# EAGLE design Circuito_Fonte (EAGLE 9.6.2)

## Sheet 1 of 2

## Sheet 2 of 2
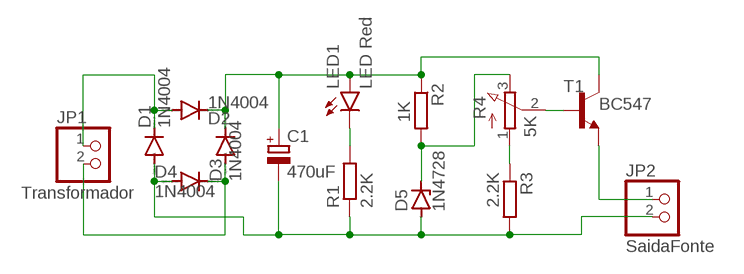
[diagram p0: schematic, sheet 2]

### Parts
C1  470uF  CPOL-EUE5-10.5  [E5-10,5]
D1  1N4004  [DO41-10]
D2  1N4004  [DO41-10]
D3  1N4004  [DO41-10]
D4  1N4004  [DO41-10]
D5  1N4728  [DO41Z10]
JP1  Transformador  PINHD-1X2  [1X02]
JP2  SaidaFonte  PINHD-1X2  [1X02]
LED1  LED Red  LED5MM  [LED5MM]
R1  2.2K  R-EU_0204/7  [0204/7]
R2  1K  R-EU_0204/7  [0204/7]
R3  2.2K  R-EU_0204/7  [0204/7]
R4  5K  3RP/1610N  [3RP/1610N]
T1  BC547  [TO92]

### Nets
N$1: D1.C D2.A JP1.1
N$2: D3.A D4.C JP1.2
N$3: C1.+ D2.C D3.C LED1.A R2.1 T1.3(C)
N$4: LED1.K(C) R1.2
N$5: D5.C R2.2 R4.3(E)
N$7: R3.1 R4.1(A)
N$8: R4.2(S) T1.2(B)
N$9: JP2.1 T1.1(E)
N$10: C1.- D1.A D4.A D5.A JP2.2 R1.1 R3.2

## Library data of the parts
C1 = rcl:CPOL-EU: POLARIZED CAPACITOR, European symbol; SPICEPREFIX: C
D1-D4 = diode:1N4004: DIODE general purpose rectifier, 1 A
D5 = diode:1N4728: Z DIODE 3.3 V, 1W, 5 percent
JP1 JP2 = pinhead:PINHD-1X2: PIN HEADER
LED1 = led:LED: LED OSRAM: - CHIPLED LG R971, LG N971, LY N971, LG Q971, LY Q971, LO R971, LY R971 LH N974, LH R974 LS Q976, LO Q976, LY Q976 LO Q996 - Hyper CHIPLED LW Q18S LB Q993, LB Q99A, LB R99A - SideLED LS A670, LO A670, LY A670, LG A670, LP A670 LB A673, LV A673, LT A673, LW A673 LH A674 LY A675 LS A676, LA A676, LO A676, LY A676, LW A676 LS A679, LY A679, LG A679 - Hyper Micro SIDELED® LS Y876, LA Y876, LO Y876, LY Y876 LT Y87S - SmartLED LW L88C, LW L88S LB L89C, LB L89S, LG L890 LS L89K, LO L89K, LY L89K LS L896, LA L896, LO L896, LY L896 - TOPLED LS T670, LO T670, LY T670, LG T670, LP T670 LSG T670, LSP T670, LSY T670, LOP T670, LYG T670 LG T671, LOG T671, LSG T671 LB T673, LV T673, LT T673, LW T673 LH T674 LS T676, LA T676, LO T676, LY T676, LB T676, LH T676, LSB T676, LW T676 LB T67C, LV T67C, LT T67C, LS T67K, LO T67K, LY T67K, LW E67C LS E67B, LA E67B, LO E67B, LY E67B, LB E67C, LV E67C, LT E67C LW T67C LS T679, LY T679, LG T679 LS T770, LO T770, LY T770, LG T770, LP T770 LB T773, LV T773, LT T773, LW T773 LH T774 LS E675, LA E675, LY E675, LS T675 LS T776, LA T776, LO T776, LY T776, LB T776 LHGB T686 LT T68C, LB T68C - Hyper Mini TOPLED® LB M676 - Mini TOPLED Santana® LG M470 LS M47K, LO M47K, LY M47K Source: http://www.osram.convergy.de LUXEON: - LUMILED® LXK2-PW12-R00, LXK2-PW12-S00, LXK2-PW14-U00, LXK2-PW14-V00 LXK2-PM12-R00, LXK2-PM12-S00, LXK2-PM14-U00 LXK2-PE12-Q00, LXK2-PE12-R00, LXK2-PE12-S00, LXK2-PE14-T00, LXK2-PE14-U00 LXK2-PB12-K00, LXK2-PB12-L00, LXK2-PB12-M00, LXK2-PB14-N00, LXK2-PB14-P00, LXK2-PB14-Q00 LXK2-PR12-L00, LXK2-PR12-M00, LXK2-PR14-Q00, LXK2-PR14-R00 LXK2-PD12-Q00, LXK2-PD12-R00, LXK2-PD12-S00 LXK2-PH12-R00, LXK2-PH12-S00 LXK2-PL12-P00, LXK2-PL12-Q00, LXK2-PL12-R00 Source: www.luxeon.com KINGBRIGHT: KA-3528ASYC Source: www.kingbright.com
R1-R3 = rcl:R-EU_: RESISTOR, European symbol; SPICEPREFIX: R
R4 = pot:3RP/1610N: 16mm Potentiometer one level Source: http://www.alphapotentiometers.net/html/16mm_pot_2.html
T1 = transistor:BC547: NPN TRANSISTOR

## Board
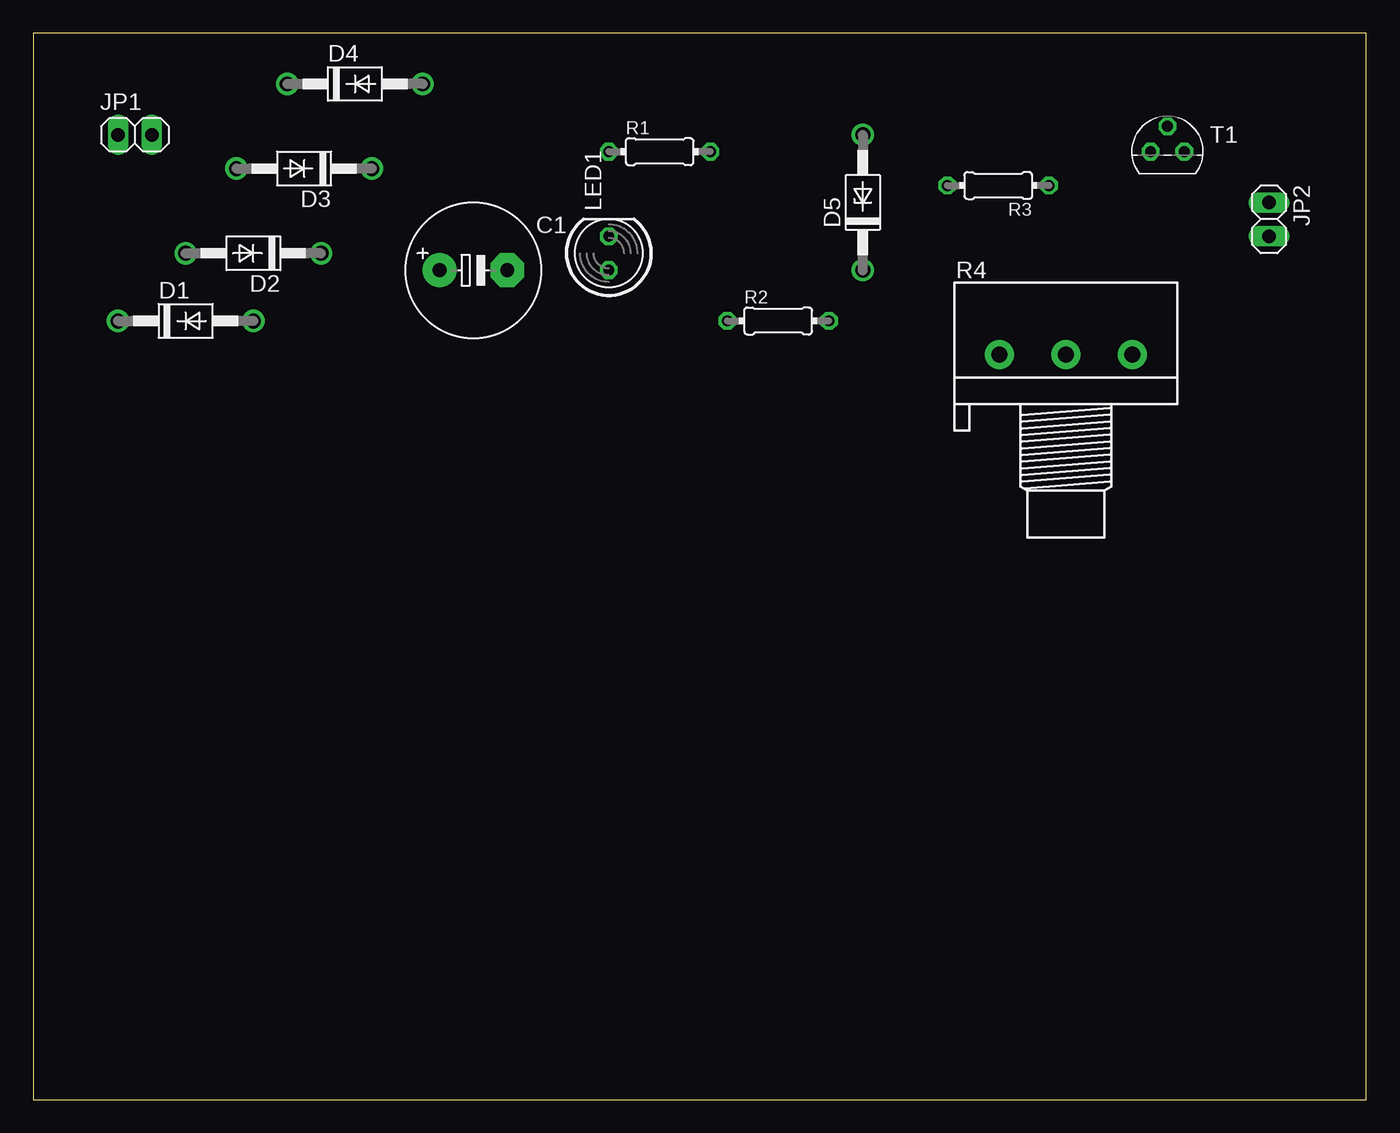
[diagram p1: board, top side]
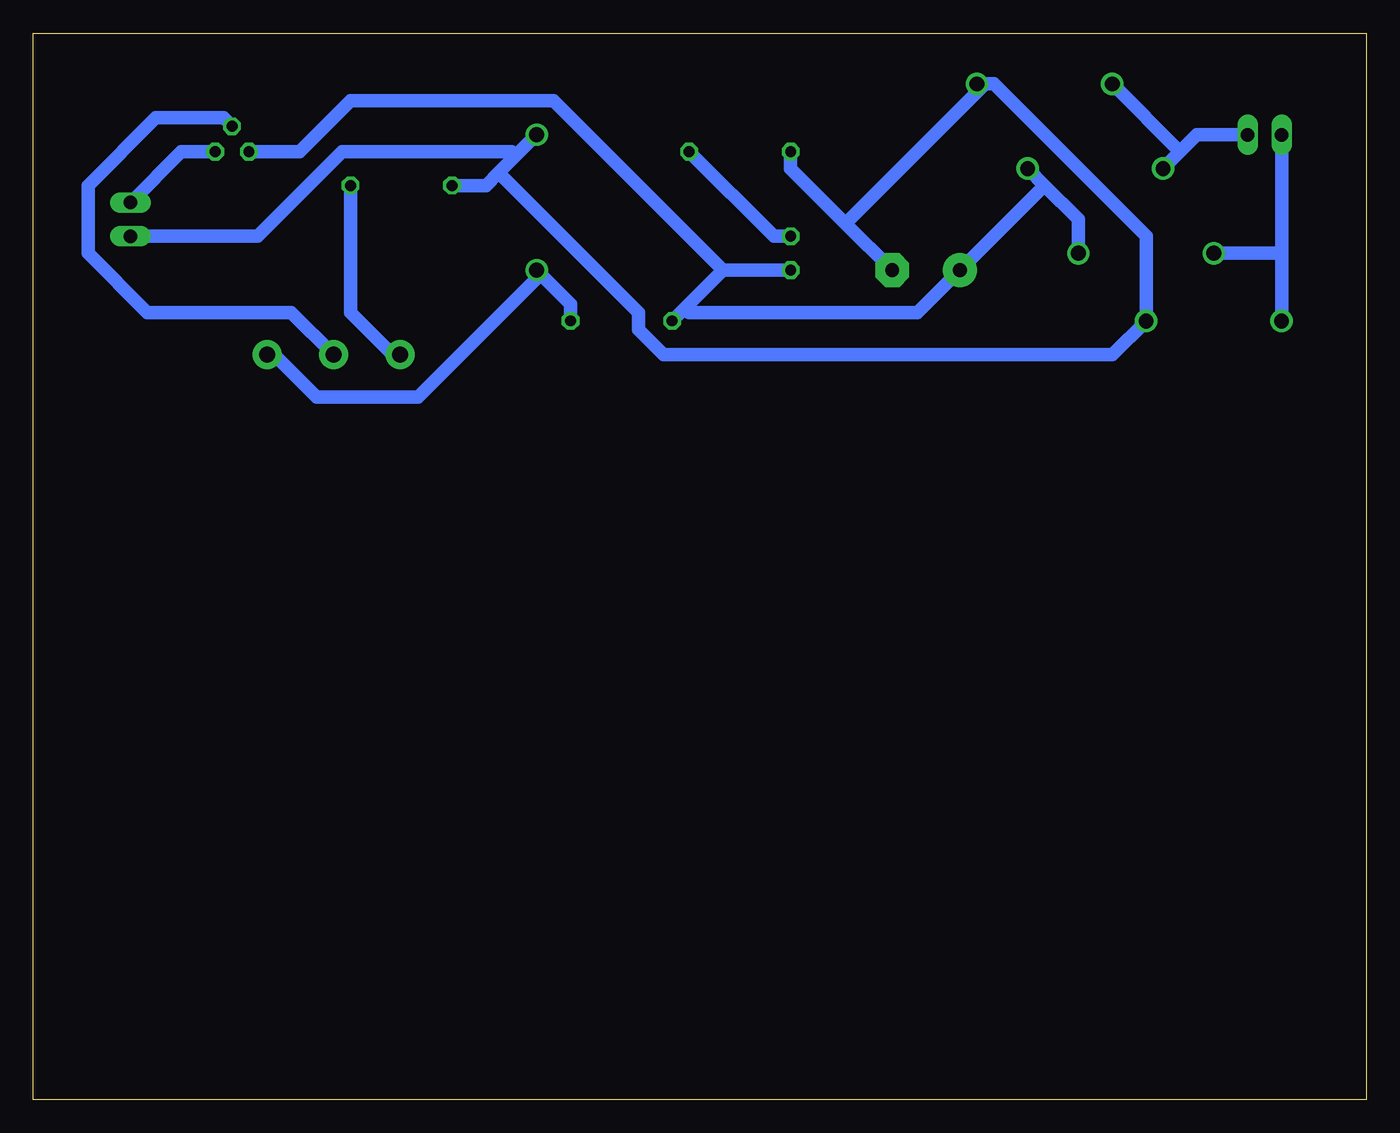
[diagram p2: board, bottom side, seen from below]

Size 100 x 80 mm. Coordinates in mm from the lower left corner, seen from the top.
Outline: 0,0 100,0 100,80 0,80 0,0
Copper layers (1*16): Top 0.035mm / dielectric 1.5mm / Bottom 0.035mm
Design rules "default *": minimum track width 40mil, minimum drill 0.35mm, track to track 40mil, track to pad 40mil, pad to pad 40mil, via to via 40mil, smd to smd 6mil, copper to edge 40mil, drill to drill 6mil, minimum pad ring 10mil, minimum via ring 8mil, stop-mask expansion 4mil, vias tented up to drill 0mil, thermal gap 10mil

### Footprints (pad centres in the part's own frame; a part is rotated, then mirrored left to right if it is on the bottom)
E5-10,5 = drill 1.016 pad 2.54: + -2.54,0 | drill 1.016 pad 2.54 octagon: - 2.54,0
DO41-10 = drill 1.118: A 5.08,0; C -5.08,0
DO41Z10 = drill 1.118: A 5.08,0; C -5.08,0
1X02 = drill 1.016 long: 1 -1.27,0; 2 1.27,0
LED5MM = drill 0.813 octagon: A -1.27,0; K 1.27,0
0204/7 = drill 0.813 octagon: 1 -3.81,0; 2 3.81,0
3RP/1610N = drill 1.2 pad 2.184: 1 -5,0; 2 0,0; 3 5,0
TO92 = drill 0.813 octagon: 1 1.27,0; 2 0,1.905; 3 -1.27,0

### Placement (x,y rotation side)
C1  33.02,62.23 0 top
D1  11.43,58.42 0 top
D2  16.51,63.5 180 top
D3  20.32,69.85 180 top
D4  24.13,76.2 0 top
D5  62.23,67.31 90 top
JP1  7.62,72.39 0 top
JP2  92.71,66.04 270 top
LED1  43.18,63.5 90 top
R1  46.99,71.12 0 top
R2  55.88,58.42 0 top
R3  72.39,68.58 180 top
R4  77.47,55.88 0 top
T1  85.09,71.12 0 top

### Tracks (layer width: path | path; a pad name or v marks a point on that pad's centre or on a via)
N$1
  Bottom 1.016: D1.C 6.35,63.5 | 6.35,63.5 JP1.1 | 6.35,63.5 D2.A
N$2
  Bottom 1.016: JP1.2 12.7,72.39 13.97,71.12 | D3.A 13.97,71.12 | 13.97,71.12 D4.C
N$3
  Bottom 1.016: D2.C 21.59,66.04 24.13,68.58 | D3.C 24.13,68.58 | 24.13,68.58 C1.+ 33.66,59.05 50.8,59.05 51.12,59.37 | 48.26,62.23 LED1.A | R2.1 51.12,59.37 | 51.12,59.37 48.26,62.23 | T1.3 80.01,71.12 76.2,74.93 60.96,74.93 48.26,62.23
N$4
  Bottom 1.016: LED1.K 44.45,64.77 R1.2
N$5
  Bottom 1.016: R2.2 59.69,59.69 D5.C 62.23,61.59 71.12,52.7 78.74,52.7 81.92,55.88 R4.3
N$7
  Bottom 1.016: R3.1 76.2,59.05 73.03,55.88 R4.1
N$8
  Bottom 1.016: T1.2 85.72,73.66 90.81,73.66 95.89,68.58 95.89,63.5 91.44,59.05 80.64,59.05 R4.2
N$9
  Bottom 1.016: T1.1 88.9,71.12 JP2.1
N$10
  Bottom 1.016: R3.2 66.04,68.58 65.09,69.53 | D5.A 63.82,70.8 | 63.82,70.8 65.09,69.53 | JP2.2 83.19,64.77 76.83,71.12 64.14,71.12 63.82,70.8 | R1.1 43.18,69.85 39.05,65.72 | C1.- 39.05,65.72 | 28.57,76.2 27.94,76.2 16.51,64.77 D1.A 19.05,55.88 52.7,55.88 54.61,57.78 54.61,59.05 65.09,69.53 | 28.57,76.2 39.05,65.72 | 28.57,76.2 D4.A